# Altium project Droppy_v1.PrjPcb
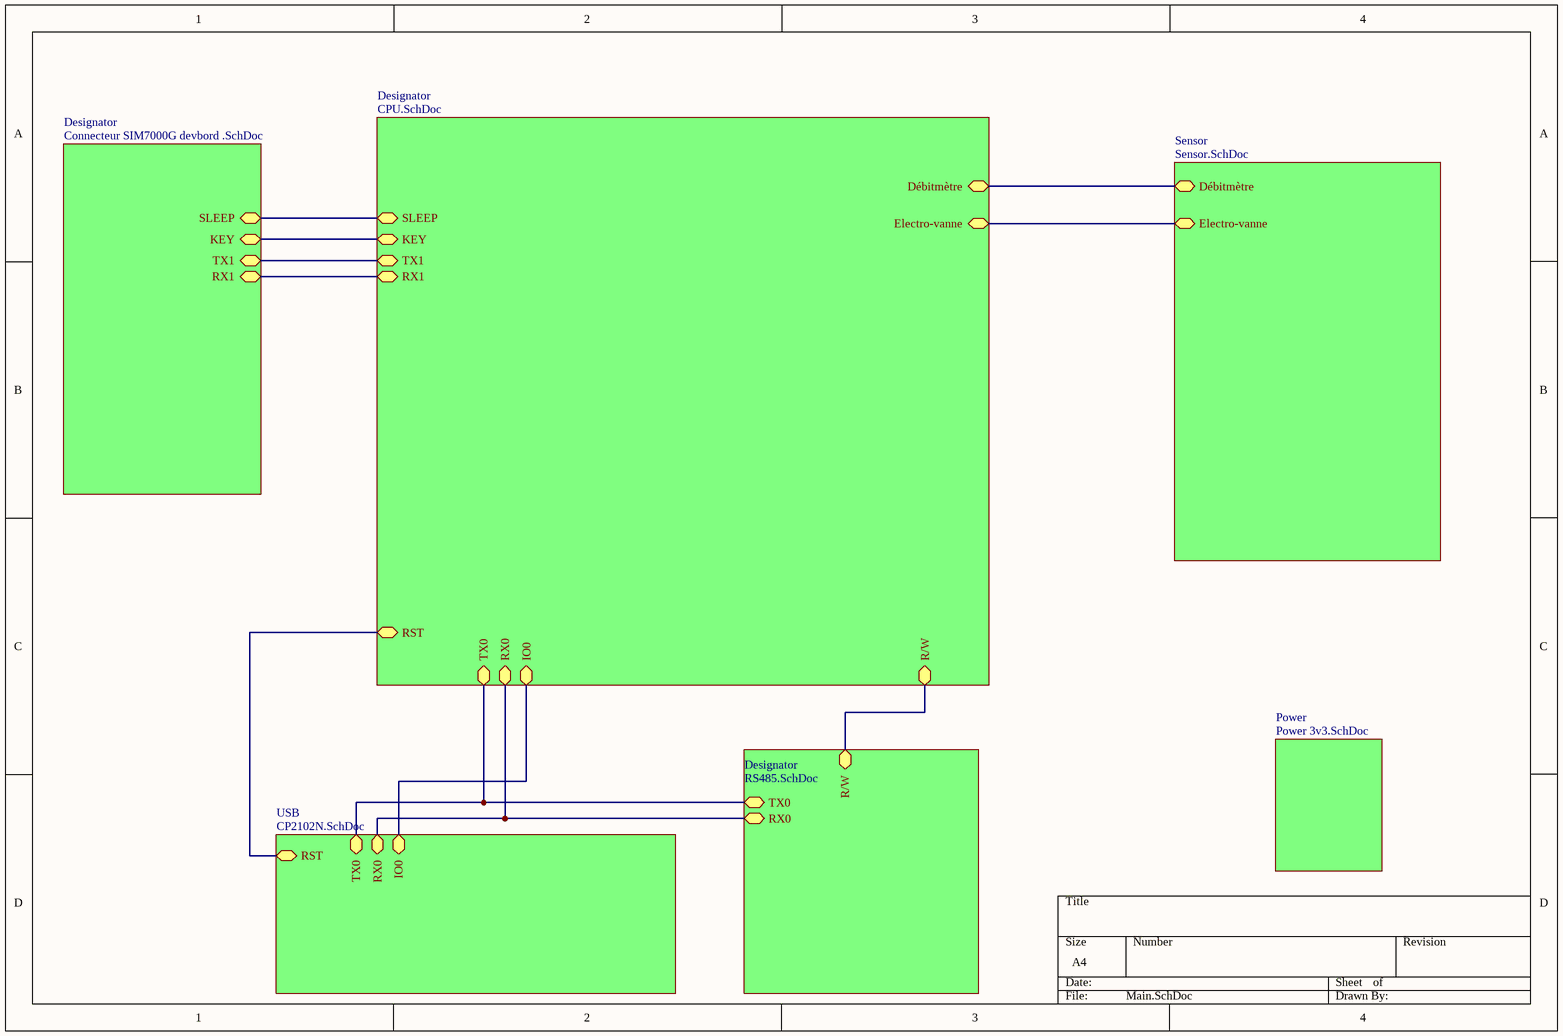
[diagram p0: Main.SchDoc]
7 sheets, 48 parts. Net scope: hierarchical (ports join the sheet entries above them; power ports are global).
Board file: PCB_Droppy_v1.PcbDoc
Sheets:
  Main.SchDoc
    Designator = CPU.SchDoc
    USB = CP2102N.SchDoc
    Power = Power 3v3.SchDoc
    Sensor = Sensor.SchDoc
    Designator = Connecteur SIM7000G devbord .SchDoc
    Designator = RS485.SchDoc

## Sheet Main.SchDoc
size A4; SheetNumber: 1; SheetTotal: 7

### Sub-sheets
Designator = CPU.SchDoc: IO0 (bidir), KEY (bidir), Débitmètre (bidir), Electro-vanne (bidir), R/W (bidir), SLEEP (bidir), RX1 (bidir), TX1 (bidir), TX0 (bidir), RX0 (bidir), RST (bidir)
Designator = Connecteur SIM7000G devbord .SchDoc: RX1 (bidir), TX1 (bidir), KEY (bidir), SLEEP (bidir)
Designator = RS485.SchDoc: RX0 (bidir), TX0 (bidir), R/W (bidir)
Power = Power 3v3.SchDoc: no entries
Sensor = Sensor.SchDoc: Débitmètre (bidir), Electro-vanne (bidir)
USB = CP2102N.SchDoc: TX0 (bidir), RX0 (bidir), IO0 (bidir), RST (bidir)

### Nets
Boot: sheet Designator/IO0, sheet USB/IO0
NetB1_25: sheet Designator/TX0, sheet USB/TX0, sheet Designator/TX0
NetB1_26: sheet Designator/RX0, sheet USB/RX0, sheet Designator/RX0
NetB4_2: sheet Designator/R/W, sheet Designator/R/W
NetC5_2: sheet Designator/Débitmètre, sheet Sensor/Débitmètre
NetJ4_1: sheet Designator/SLEEP, sheet Designator/SLEEP
NetJ4_4: sheet Designator/KEY, sheet Designator/KEY
NetJ4_5: sheet Designator/TX1, sheet Designator/TX1
NetJ4_6: sheet Designator/RX1, sheet Designator/RX1
NetQ1_6: sheet Designator/RST, sheet USB/RST
NetQ2_1: sheet Designator/Electro-vanne, sheet Sensor/Electro-vanne

## Sheet CPU.SchDoc
size A3; SheetNumber: 2; SheetTotal: 7
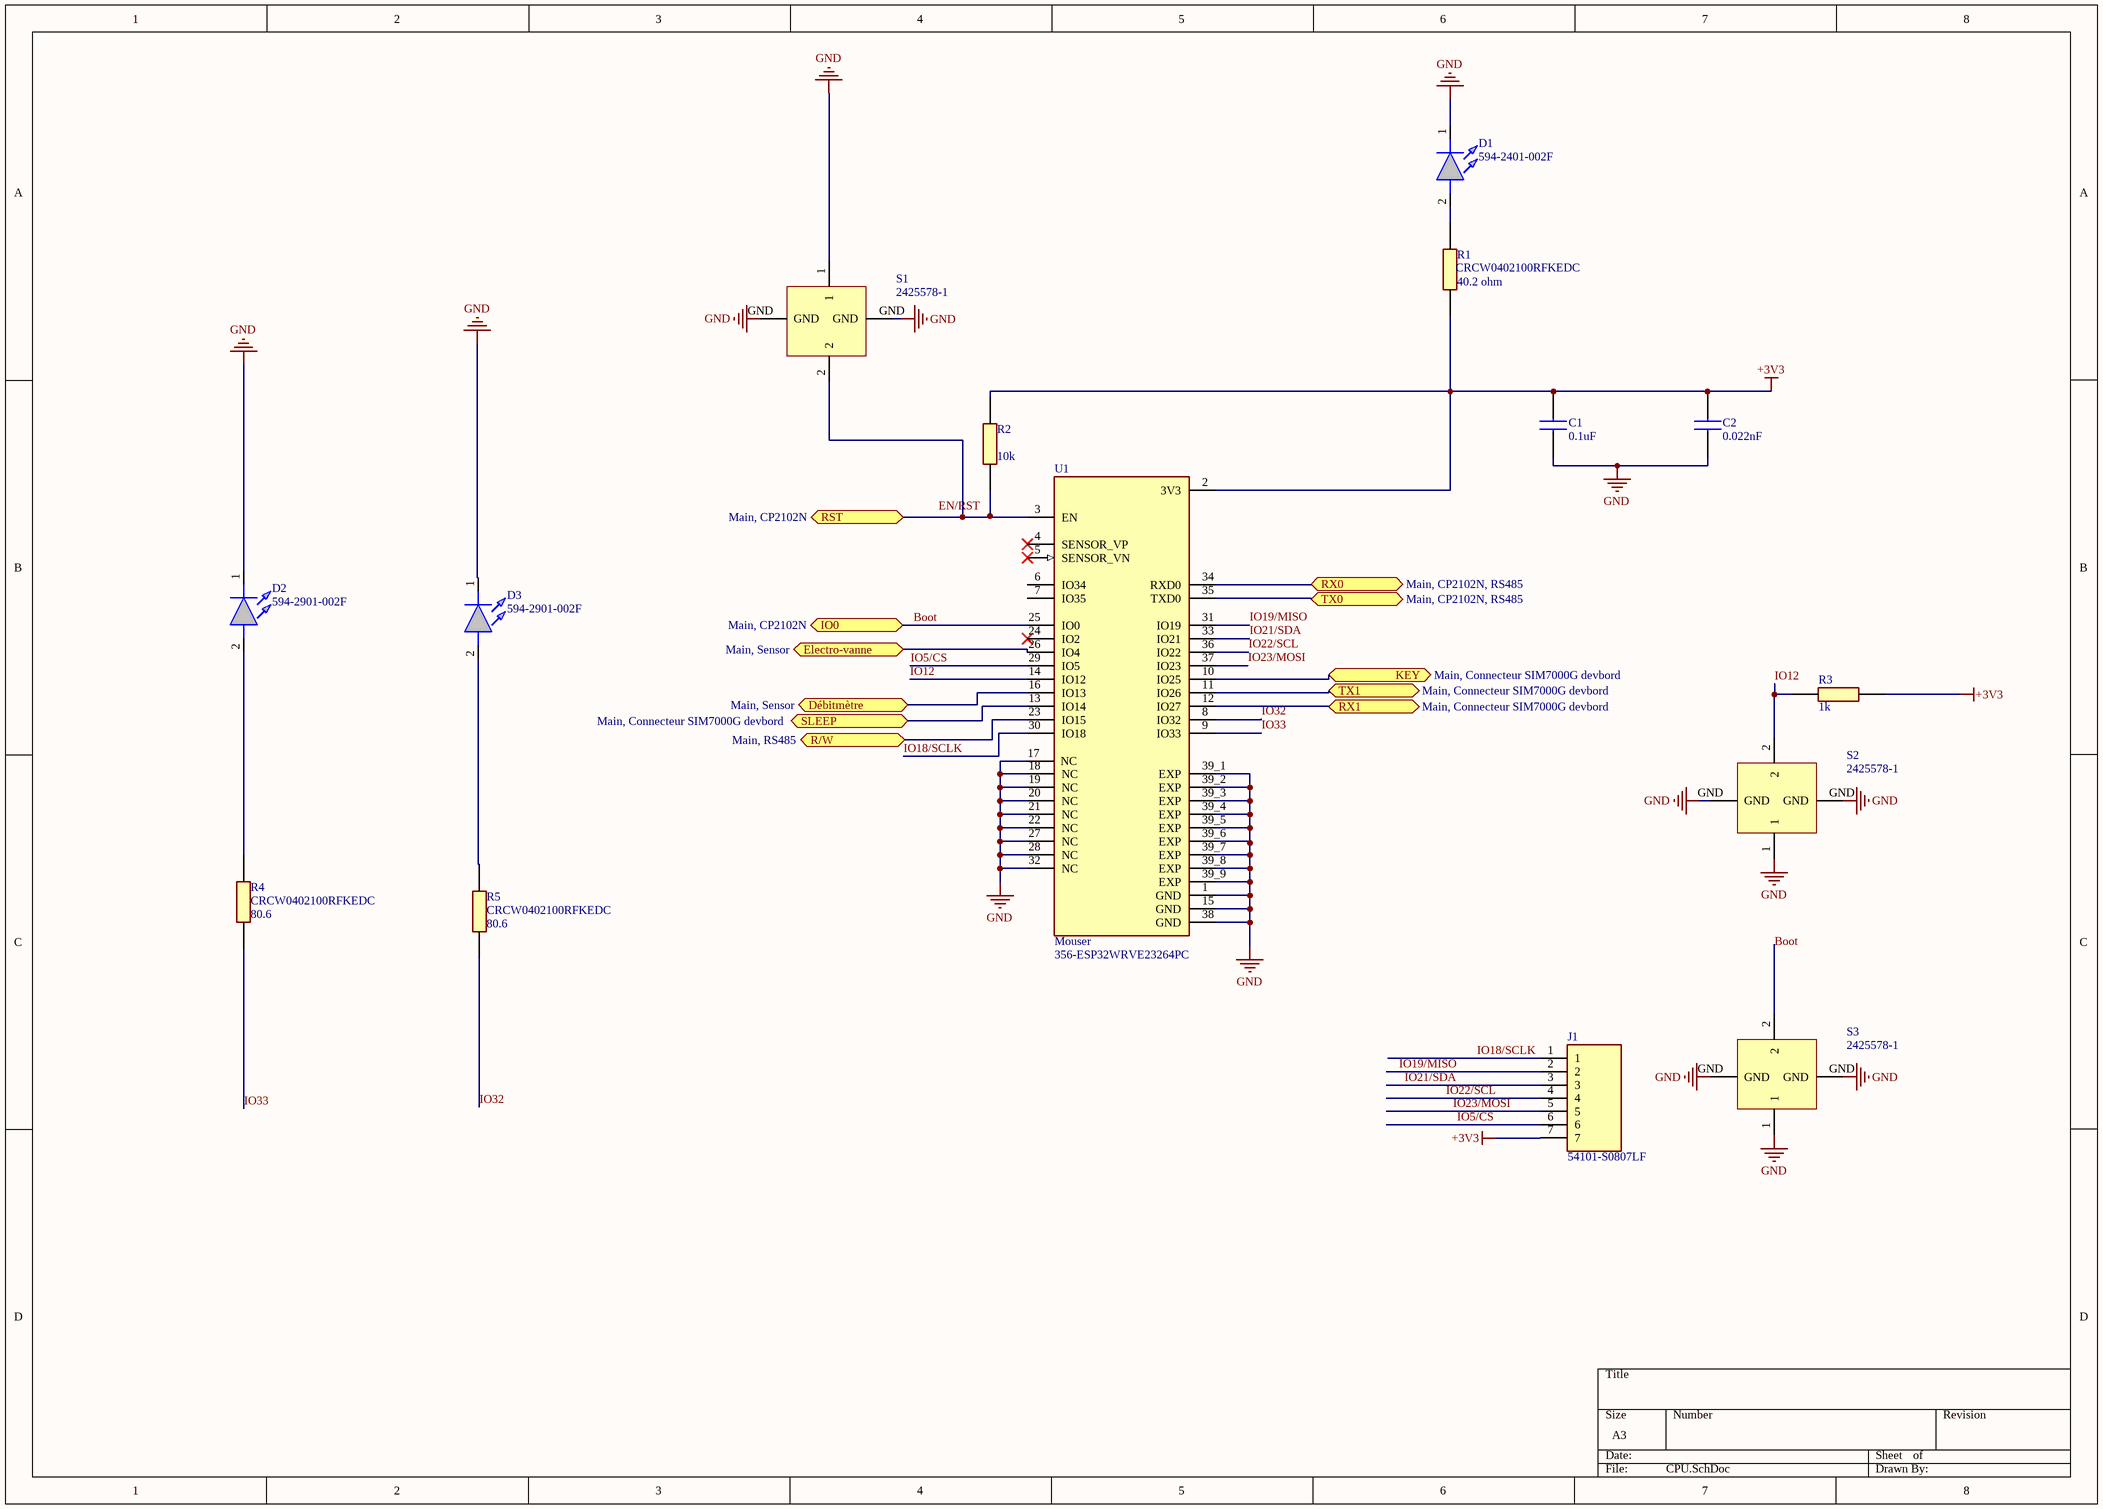
[diagram p1: CPU.SchDoc]

### Parts
C1  value 0.1uF  [CAPC1005X40N]  (hidden comment: 0402YD104KAT2A)
C2  value 0.022nF  [CAPC1005X40N]  (hidden comment: 0402ZD223KAT2A)
D1  594-2401-002F  [5942604013F]
D2  594-2901-002F  [5942604013F]
D3  594-2901-002F  [5942604013F]
J1  54101-S0807LF  [54101S0807LF]
R1  CRCW0402100RFKEDC  value 40.2 ohm  [RESC1005X40N]
R2  value 10k  [RESC1005X40N]  (hidden comment: RC0402FR-0710KL)
R3  value 1k  [RESC1005X40N]  (hidden comment: RT0402BRE071KL)
R4  CRCW0402100RFKEDC  value 80.6  [RESC1005X40N]
R5  CRCW0402100RFKEDC  value 80.6  [RESC1005X40N]
S1  2425578-1  [2425578-1]
S2  2425578-1  [2425578-1]
S3  2425578-1  [2425578-1]
U1  Supplier 1: Mouser  Supplier Part Number 1: 356-ESP32WRVE23264PC  [XCVR_ESP32-WROVER-E-N4R8]  (hidden comment: ESP32-WROVER-IE-N16R8)

### Ports
Débitmètre (bidir, see Main, Sensor), Electro-vanne (bidir, see Main, Sensor), IO0 (bidir, see Main, CP2102N), KEY (bidir, see Main, Connecteur SIM7000G devbord), R/W (bidir, see Main, RS485), RST (bidir, see Main, CP2102N), RX0 (bidir, see Main, CP2102N, RS485), RX1 (bidir, see Main, Connecteur SIM7000G devbord), SLEEP (bidir, see Main, Connecteur SIM7000G devbord), TX0 (bidir, see Main, CP2102N, RS485), TX1 (bidir, see Main, Connecteur SIM7000G devbord)

### Nets
+3V3: C1.2 C2.2 J1.7 R1.1 R2.2 R3.1 U1.2(3V3)
GND: C1.1 C2.1 D1.1(K) D2.1(K) D3.1(K) S1.1 S1.GND S2.1 S2.GND S3.1 S3.GND U1.1(GND) U1.15(GND) U1.17(NC) U1.18(NC) U1.19(NC) U1.20(NC) U1.21(NC) U1.22(NC) U1.27(NC) U1.28(NC) U1.32(NC) U1.38(GND) U1.39_1(EXP) U1.39_2(EXP) U1.39_3(EXP) U1.39_4(EXP) U1.39_5(EXP) U1.39_6(EXP) U1.39_7(EXP) U1.39_8(EXP) U1.39_9(EXP)
Boot: S3.2 U1.25(IO0) ; port IO0
IO5/CS: J1.6 U1.29(IO5)
IO12: R3.2 S2.2 U1.14(IO12)
IO18/SCLK: J1.1 U1.30(IO18)
IO19/MISO: J1.2 U1.31(IO19)
IO21/SDA: J1.3 U1.33(IO21)
IO22/SCL: J1.4 U1.36(IO22)
IO23/MOSI: J1.5 U1.37(IO23)
IO32: R5.1 U1.8(IO32)
IO33: R4.1 U1.9(IO33)
NetB1_25: U1.35(TXD0) ; port TX0
NetB1_26: U1.34(RXD0) ; port RX0
NetB4_2: U1.23(IO15) ; port R/W
NetC5_2: U1.16(IO13) ; port Débitmètre
NetD1_2: D1.2(A) R1.2
NetD2_2: D2.2(A) R4.2
NetD3_2: D3.2(A) R5.2
NetJ4_1: U1.13(IO14) ; port SLEEP
NetJ4_4: U1.10(IO25) ; port KEY
NetJ4_5: U1.11(IO26) ; port TX1
NetJ4_6: U1.12(IO27) ; port RX1
NetQ1_6: R2.1 S1.2 U1.3(EN) ; port RST
NetQ2_1: U1.26(IO4) ; port Electro-vanne

Not connected (* = marked no-connect by the designer): U1 4(SENSOR_VP)* 5(SENSOR_VN)* 6(IO34) 7(IO35) 24(IO2)*

### Notes on the sheet
- Labels drawn without touching a wire or pin: EN/RST

### Library data of the parts
C1 = 0402YD104KAT2A: Capacitor MLCC 0402 100nF 16V AVX 0402 Standard 100nF Ceramic Multilayer Capacitor, 16 V dc, +85C, X5R Dielectric, +/-10% SMD; Geometry.Height: 0.56mm; Mouser Part Number: 581-0402YD104K; Mouser Price/Stock: https://www.mouser.co.uk/ProductDetail/AVX/0402YD104KAT2A?qs=fS3i9m8Z%2FmrV7G1UZb6Y7g%3D%3D; Manufacturer_Name: AVX; Manufacturer_Part_Number: 0402YD104KAT2A; Datasheet Link: *; Supplier Part Number 1: 0402YD104KAT2A; Supplier 1: Avnet
C2 = 0402ZD223KAT2A: Multilayer Ceramic Capacitors MLCC - SMD/SMT 10V 0.022uF X5R 0402 10%; Manufacturer_Name: AVX; Manufacturer_Part_Number: 0402YD104KAT2A; Geometry.Height: 0.56mm; Mouser Part Number: 581-0402ZD223KAT2A; Mouser Price/Stock: https://www.mouser.co.uk/ProductDetail/AVX/0402YD104KAT2A?qs=fS3i9m8Z%2FmrV7G1UZb6Y7g%3D%3D; Datasheet Link: *; Supplier Part Number 1: 0402YD104KAT2A; Supplier 1: Avnet
D1-D3 = 594-2604-013F: LED Circuit Board Indicators 1.6mm IceBlue 2mA 13in reel; Manufacturer_Name: Dialight; Geometry.Height: 4.49mm; Mouser Part Number: 645-594-2604-013F; Mouser Price/Stock: https://www.mouser.co.uk/ProductDetail/Dialight/594-2604-013F?qs=GBLSl2AkiruyIh94PfnoyA%3D%3D; Manufacturer_Part_Number: 594-2604-013F; Datasheet Link: https://www.mouser.cn/datasheet/2/109/C18409B-1729493.pdf
J1 = 54101-S0807LF: BergStik, Board to Board connector, Unshrouded vertical Header, Through Hole, Single Row, 6 Positions, 2.54 mm Pitch.; Manufacturer_Name: Amphenol Communication Solutions; Geometry.Height: 8.58mm; Mouser Part Number: 649-54101-S0807LF; Mouser Price/Stock: https://www.mouser.co.uk/ProductDetail/Amphenol-FCI/54101-S0803LF?qs=iiM6sTJtPEc921tw16XaKg%3D%3D; Manufacturer_Part_Number: 54101-S0807LF; Datasheet Link: https://cdn.amphenol-cs.com/media/wysiwyg/files/drawing/54101.pdf
R1 = CRCW040240R2FKEDC: Résistances à couches épaisses - CMS 1/16watt 40.2ohms 1% Commercial Use; Manufacturer_Name: Vishay; Geometry.Height: 0.4mm; Mouser Part Number: 71-CRCW040240R2FKEDC; Mouser Price/Stock: https://www.mouser.co.uk/ProductDetail/Vishay-Dale/CRCW04024K70JNED?qs=iWCWVRvNViwY%252BotGHUbALg%3D%3D; Manufacturer_Part_Number: CRCW040240R2FKEDC; Datasheet Link: http://www.vishay.com/docs/20035/dcrcwe3.pdf; Supplier 1: Avnet; Supplier Part Number 1: 59M6737
R2 = RC0402FR-0710KL: Yageo 10k, 0402 (1005M) Thick Film SMD Resistor +/-1% 0.063W - RC0402FR-0710KL; Geometry.Height: 0.4mm; Mouser Part Number: 603-RC0402FR-0710KL; Mouser Price/Stock: https://www.mouser.co.uk/ProductDetail/YAGEO/RC0402FR-0710KL?qs=I1mnnYJTTsxUoNwrUsQExA%3D%3D; Manufacturer_Name: YAGEO; Manufacturer_Part_Number: RC0402FR-0710KL; Datasheet Link: https://componentsearchengine.com/Datasheets/2/RC0402FR-0710KL.pdf; Supplier Part Number 1: 7468275; Supplier 1: Future Electronics
R3 = RT0402BRE071KL: Thin Film Resistors - SMD 1/16W 1K ohm .1% 50ppm; Manufacturer_Name: YAGEO; Geometry.Height: 0.4mm; Mouser Part Number: 603-RT0402BRE071KL; Mouser Price/Stock: https://www.mouser.co.uk/ProductDetail/YAGEO/RC0402FR-0710KL?qs=I1mnnYJTTsxUoNwrUsQExA%3D%3D; Manufacturer_Part_Number: RT0402BRE071KL; Datasheet Link: https://componentsearchengine.com/Datasheets/2/RC0402FR-0710KL.pdf; Supplier 1: Future Electronics; Supplier Part Number 1: 3025706
R4 R5 = CRCW040280R6FKED: Résistances à couches épaisses - CMS 1/16watt 80.6ohms 1%; Manufacturer_Name: Vishay; Geometry.Height: 0.4mm; Mouser Part Number: 71-CRCW0402-80.6-E3; Mouser Price/Stock: https://www.mouser.co.uk/ProductDetail/Vishay-Dale/CRCW04024K70JNED?qs=iWCWVRvNViwY%252BotGHUbALg%3D%3D; Manufacturer_Part_Number: CRCW040280R6FKED; Datasheet Link: http://www.vishay.com/docs/20035/dcrcwe3.pdf; Supplier 1: Avnet; Supplier Part Number 1: 59M6737
S1-S3 = 2425578-1: Interrupteurs de contact Edge mount, right angle tactile, 160gf
U1 = ESP32-WROVER-E-N4R8: Bluetooth, WiFi 802.11b/g/n, Bluetooth v4.2 +EDR Transceiver Module 2.4GHz ~ 2.5GHz PCB Trace Surface Mount; MF: Espressif Systems; MP: ESP32WROVEREN4R8; SnapEDA_Link: https://www.snapeda.com/parts/ESP32WROVEREN4R8/Espressif+Systems/view-part/?ref=snap; Price: None; Check_prices: https://www.snapeda.com/parts/ESP32WROVEREN4R8/Espressif+Systems/view-part/?ref=eda; Value: *; Package: None; Availability: In Stock; Purchase-URL: https://pricing.snapeda.com/search/part/ESP32WROVEREN4R8/?ref=eda

## Sheet CP2102N.SchDoc
size A3; SheetNumber: 3; SheetTotal: 7
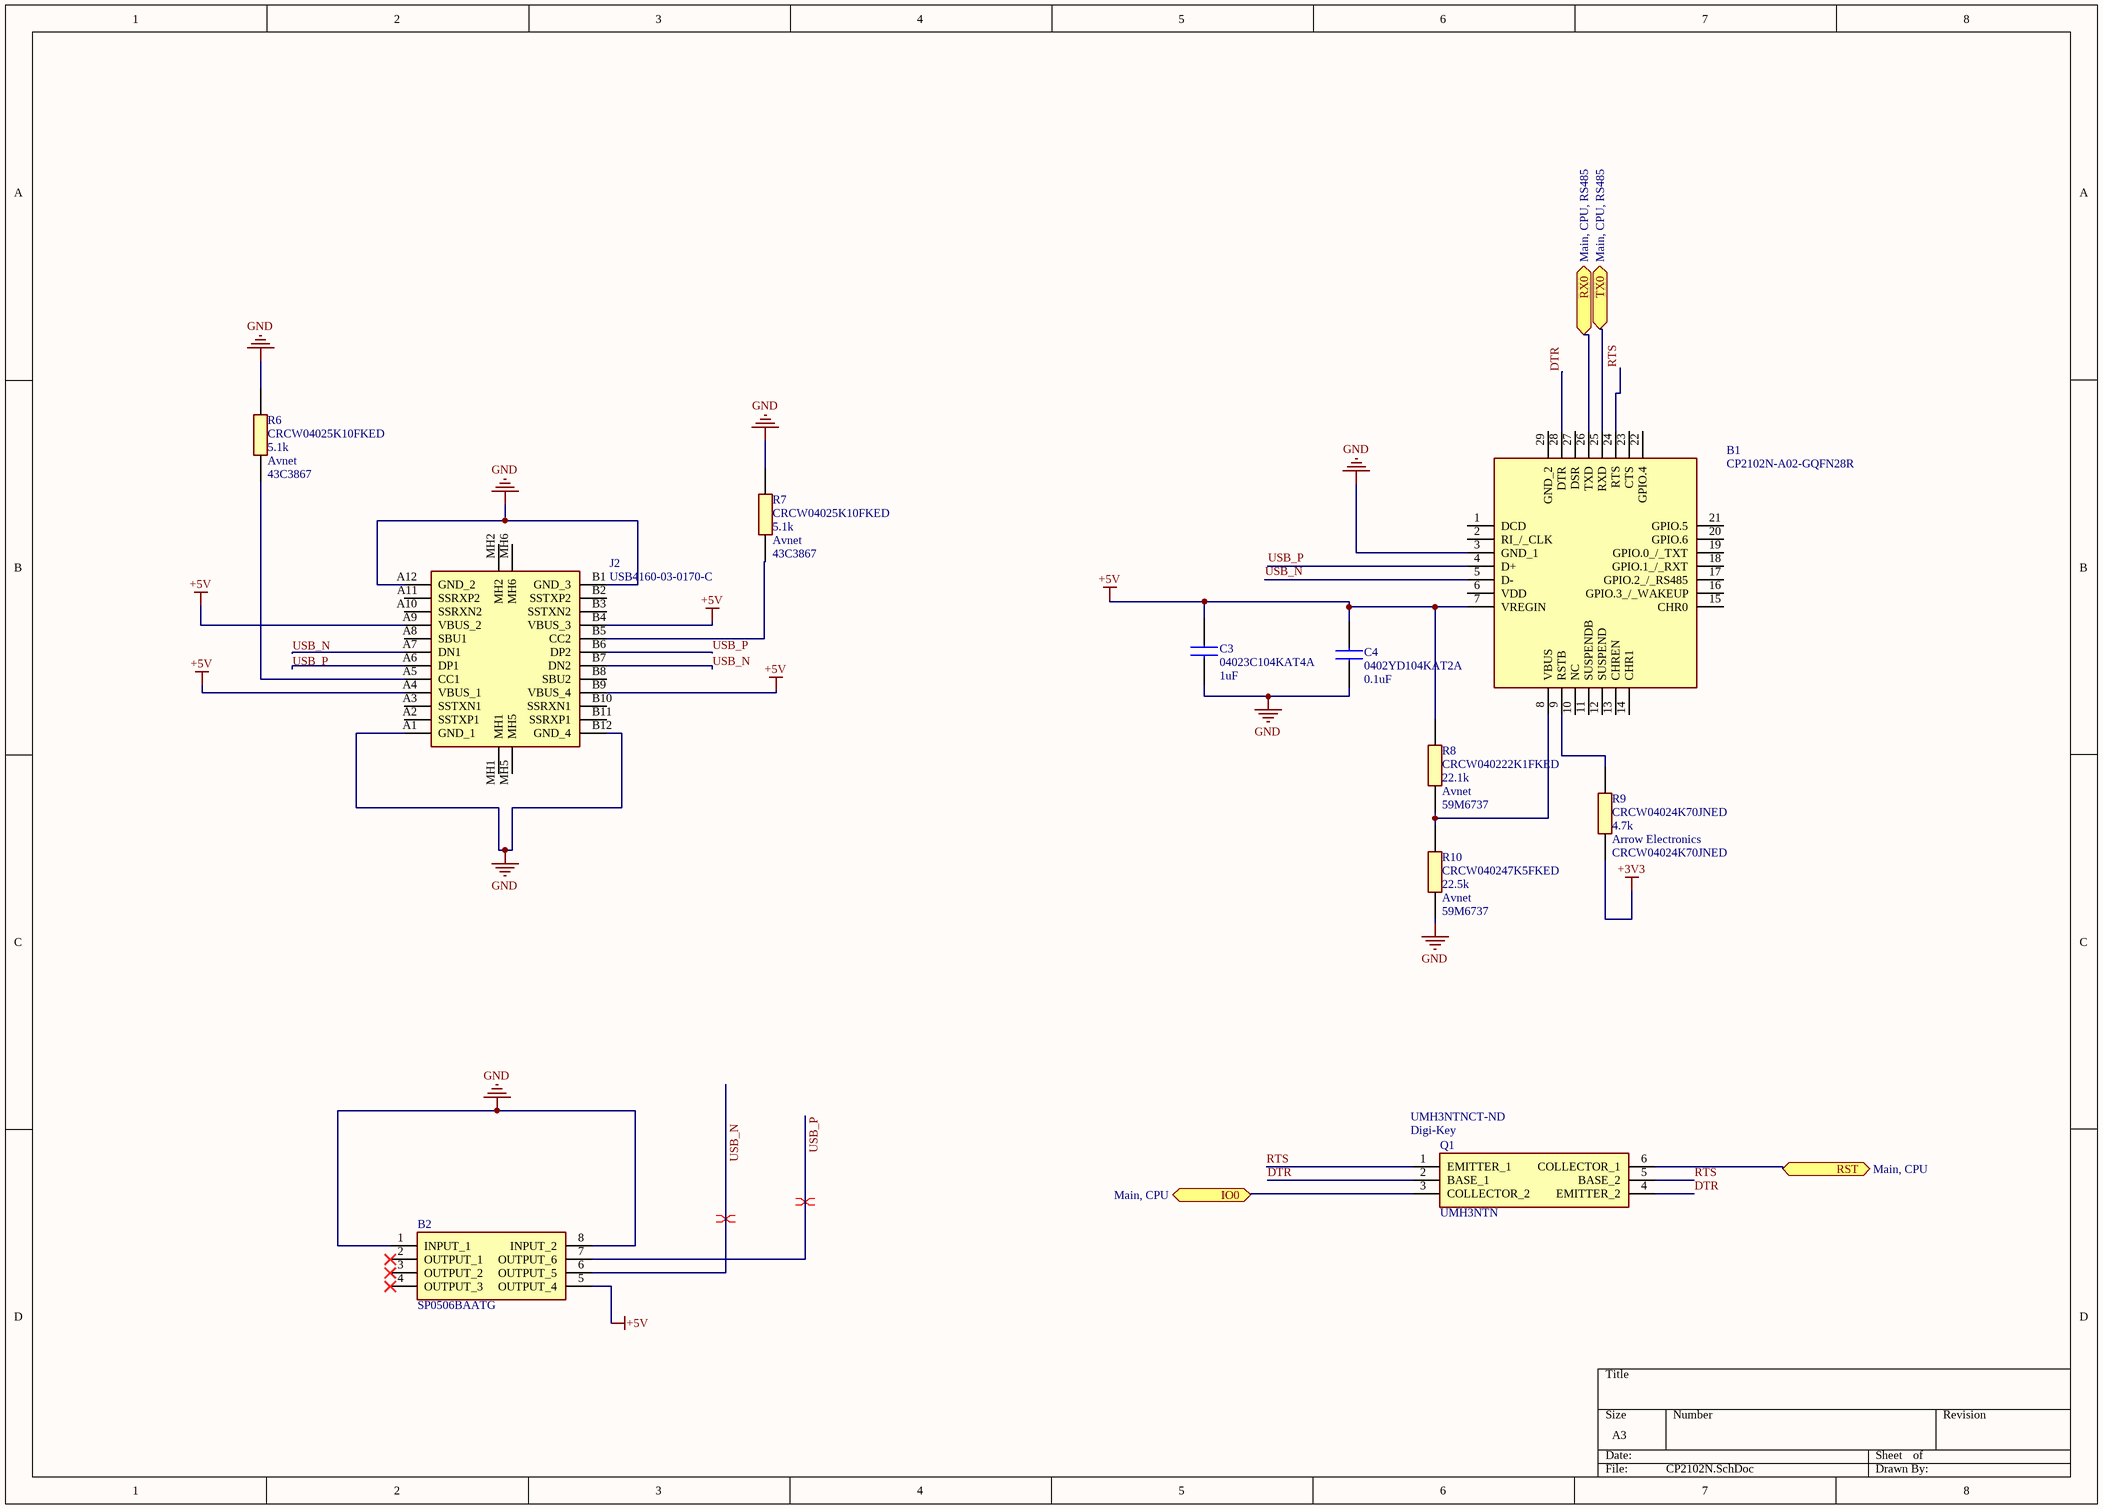
[diagram p2: CP2102N.SchDoc]

### Parts
B1  CP2102N-A02-GQFN28R  [QFN50P500X500X80-29N-D]
B2  SP0506BAATG  [SOP65P488X117-8N]
C3  04023C104KAT4A  value 1uF  [CAPC1005X40N]
C4  0402YD104KAT2A  value 0.1uF  [CAPC1005X40N]
J2  USB4160-03-0170-C  [USB4160030170C]
Q1  UMH3NTN  Supplier 1: Digi-Key  Supplier Part Number 1: UMH3NTNCT-ND  [UMH3NTN]
R6  CRCW04025K10FKED  value 5.1k  Supplier 1: Avnet  Supplier Part Number 1: 43C3867  [RESC1005X40N]
R7  CRCW04025K10FKED  value 5.1k  Supplier 1: Avnet  Supplier Part Number 1: 43C3867  [RESC1005X40N]
R8  CRCW040222K1FKED  value 22.1k  Supplier 1: Avnet  Supplier Part Number 1: 59M6737  [RESC1005X40N]
R9  CRCW04024K70JNED  value 4.7k  Supplier 1: Arrow Electronics  [RESC1005X40N]
R10  CRCW040247K5FKED  value 22.5k  Supplier 1: Avnet  Supplier Part Number 1: 59M6737  [RESC1005X40N]

### Ports
IO0 (bidir, see Main, CPU), RST (bidir, see Main, CPU), RX0 (bidir, see Main, CPU, RS485), TX0 (bidir, see Main, CPU, RS485)

### Nets
+3V3: R9.1
+5V: B1.7(VREGIN) B2.5(OUTPUT_4) C3.2 C4.2 J2.A4(VBUS_1) J2.A9(VBUS_2) J2.B4(VBUS_3) J2.B9(VBUS_4) R8.2
GND: B1.3(GND_1) B2.1(INPUT_1) B2.8(INPUT_2) C3.1 C4.1 J2.A1(GND_1) J2.A12(GND_2) J2.B1(GND_3) J2.B12(GND_4) R6.2 R7.2 R10.1
Boot: Q1.3(COLLECTOR_2) ; port IO0
DTR: B1.28(DTR) Q1.2(BASE_1) Q1.4(EMITTER_2)
RTS: B1.24(RTS) Q1.1(EMITTER_1) Q1.5(BASE_2)
USB_N: B1.5(D-) B2.6(OUTPUT_5) J2.A7(DN1) J2.B7(DN2)
USB_P: B1.4(D+) B2.7(OUTPUT_6) J2.A6(DP1) J2.B6(DP2)
NetB1_8: B1.8(VBUS) R8.1 R10.2
NetB1_9: B1.9(RSTB) R9.2
NetB1_25: B1.25(RXD) ; port TX0
NetB1_26: B1.26(TXD) ; port RX0
NetJ2_A5: J2.A5(CC1) R6.1
NetJ2_B5: J2.B5(CC2) R7.1
NetQ1_6: Q1.6(COLLECTOR_1) ; port RST

Not connected (* = marked no-connect by the designer): B1 1(DCD) 2(RI_/_CLK) 6(VDD) 10(NC) 11(SUSPENDB) 12(SUSPEND) 13(CHREN) 14(CHR1) 15(CHR0) 16(GPIO.3_/_WAKEUP) 17(GPIO.2_/_RS485) 18(GPIO.1_/_RXT) 19(GPIO.0_/_TXT) 20(GPIO.6) 21(GPIO.5) 22(GPIO.4) 23(CTS) 27(DSR) 29(GND_2); B2 2(OUTPUT_1)* 3(OUTPUT_2)* 4(OUTPUT_3)*; J2 A2(SSTXP1) A3(SSTXN1) A8(SBU1) A10(SSRXN2) A11(SSRXP2) B2(SSTXP2) B3(SSTXN2) B8(SBU2) B10(SSRXN1) B11(SSRXP1) MH1 MH2 MH5 MH6

### Layout directives
differential pair: USB_N, USB_P

### Library data of the parts
B1 = CP2102N-A02-GQFN28R: USB Interface IC USB to UART bridge - QFN28; Manufacturer_Name: Silicon Labs; Geometry.Height: 0.8mm; Manufacturer_Part_Number: CP2102N-A02-GQFN28R; Mouser Part Number: 634-CP2102NA02QFN28R; Mouser Price/Stock: https://www.mouser.co.uk/ProductDetail/Silicon-Labs/CP2102N-A02-GQFN28R?qs=u16ybLDytRag4qKvSH3fTw%3D%3D; Arrow Part Number: CP2102N-A02-GQFN28R; Arrow Price/Stock: https://www.arrow.com/en/products/cp2102n-a02-gqfn28r/silicon-labs?region=nac; Datasheet Link: https://www.silabs.com/documents/public/data-sheets/cp2102n-datasheet.pdf
B2 = SP0506BAATG: TVS Diode Arrays; Manufacturer_Name: LITTELFUSE; Geometry.Height: 1.17mm; Mouser Part Number: 576-SP0506BAATG; Mouser Price/Stock: https://www.mouser.co.uk/ProductDetail/Littelfuse/SP0506BAATG?qs=RnOBYWd%2Fz7c6KTUitxDieg%3D%3D; Manufacturer_Part_Number: SP0506BAATG; Datasheet Link: https://www.littelfuse.com/~/media/electronics/datasheets/tvs_diode_arrays/littelfuse_tvs_diode_array_sp05_datasheet.pdf.pdf; Supplier 1: Arrow Electronics; Supplier Part Number 1: SP0506BAATG
C3 = 04023C104KAT4A: Multilayer Ceramic Capacitors MLCC - SMD/SMT 25V .1uF X7R 0402; Manufacturer_Name: AVX; Geometry.Height: 0.56mm; Mouser Part Number: 581-04023C104KAT4A; Mouser Price/Stock: https://www.mouser.co.uk/ProductDetail/AVX/0402YD104KAT2A?qs=fS3i9m8Z%2FmrV7G1UZb6Y7g%3D%3D; Manufacturer_Part_Number: 04023C104KAT4A; Datasheet Link: *; Supplier Part Number 1: 0402YD104KAT2A; Supplier 1: Avnet
C4 = 0402YD104KAT2A: as C1 on sheet CPU; Mouser Part Number: 581-0402YD104K; Mouser Price/Stock: https://www.mouser.co.uk/ProductDetail/AVX/0402YD104KAT2A?qs=fS3i9m8Z%2FmrV7G1UZb6Y7g%3D%3D; Manufacturer_Name: AVX; Manufacturer_Part_Number: 0402YD104KAT2A; Datasheet Link: *; Supplier Part Number 1: 0402YD104KAT2A; Supplier 1: Avnet
J2 = USB4160-03-0170-C: USB Connectors USB-C Rec 3u" Vert 24P SMT 1.7mm TH stakes H7.46mm T+R+Cap; Manufacturer_Name: GCT (GLOBAL CONNECTOR TECHNOLOGY); Geometry.Height: 7.66mm; Mouser Part Number: 640-USB4160-3-0170-C; Mouser Price/Stock: https://www.mouser.co.uk/ProductDetail/GCT/USB4160-03-0170-C?qs=vvQtp7zwQdMCGQNngnxScA%3D%3D; Manufacturer_Part_Number: USB4160-03-0170-C; Datasheet Link: https://gct.co/Files/Drawings/USB4160.pdf?v=75f6cea7-84cd-41d4-89e8-137dc7b10777
Q1 = UMH3NTN: Bipolar Transistors - Pre-Biased DUAL NPN 50V 100MA SOT-363; Manufacturer_Name: ROHM Semiconductor; Geometry.Height: 1mm; Mouser Part Number: 755-UMH3NTN; Mouser Price/Stock: https://www.mouser.co.uk/ProductDetail/ROHM-Semiconductor/UMH3NTN?qs=4kLU8WoGk0st6ahJ6z2bmw%3D%3D; Manufacturer_Part_Number: UMH3NTN; Datasheet Link: https://componentsearchengine.com/Datasheets/2/UMH3NTN.pdf
R6 R7 = CRCW04025K10FKED: Thick Film Resistors - SMD 3/4watt 5.1Kohms 5%; Manufacturer_Name: Vishay; Geometry.Height: 0.4mm; Mouser Part Number: 71-CRCW0402-5.1K-E3; Mouser Price/Stock: https://www.mouser.co.uk/ProductDetail/Vishay-Dale/CRCW04024K70JNED?qs=iWCWVRvNViwY%252BotGHUbALg%3D%3D; Manufacturer_Part_Number: CRCW04025K10FKED; Datasheet Link: http://www.vishay.com/docs/20035/dcrcwe3.pdf
R8 = CRCW040222K1FKED: Résistances à couches épaisses - CMS 1/16watt 22.1Kohms 1%; Manufacturer_Name: Vishay; Geometry.Height: 0.4mm; Mouser Part Number: 71-CRCW0402-22.1K-E3; Mouser Price/Stock: https://www.mouser.co.uk/ProductDetail/Vishay-Dale/CRCW04024K70JNED?qs=iWCWVRvNViwY%252BotGHUbALg%3D%3D; Manufacturer_Part_Number: CRCW040222K1FKED; Datasheet Link: http://www.vishay.com/docs/20035/dcrcwe3.pdf
R9 = CRCW04024K70JNED: VISHAY - CRCW04024K70JNED - RES, THICK FILM, 4K7, 5%, 0.063W, 0402; Geometry.Height: 0.4mm; Mouser Part Number: 71-CRCW0402J-4.7K-E3; Mouser Price/Stock: https://www.mouser.co.uk/ProductDetail/Vishay-Dale/CRCW04024K70JNED?qs=iWCWVRvNViwY%252BotGHUbALg%3D%3D; Manufacturer_Name: Vishay; Manufacturer_Part_Number: CRCW04024K70JNED; Datasheet Link: http://www.vishay.com/docs/20035/dcrcwe3.pdf; Supplier Part Number 1: CRCW04024K70JNED
R10 = CRCW040247K5FKED: Résistances à couches épaisses - CMS 1/16watt 47.5Kohms 1%; Manufacturer_Name: Vishay; Geometry.Height: 0.4mm; Mouser Part Number: 71-CRCW0402-47.5K-E3; Mouser Price/Stock: https://www.mouser.co.uk/ProductDetail/Vishay-Dale/CRCW04024K70JNED?qs=iWCWVRvNViwY%252BotGHUbALg%3D%3D; Manufacturer_Part_Number: CRCW040247K5FKED; Datasheet Link: http://www.vishay.com/docs/20035/dcrcwe3.pdf

## Sheet Power 3v3.SchDoc
size A4; SheetNumber: 5; SheetTotal: 7
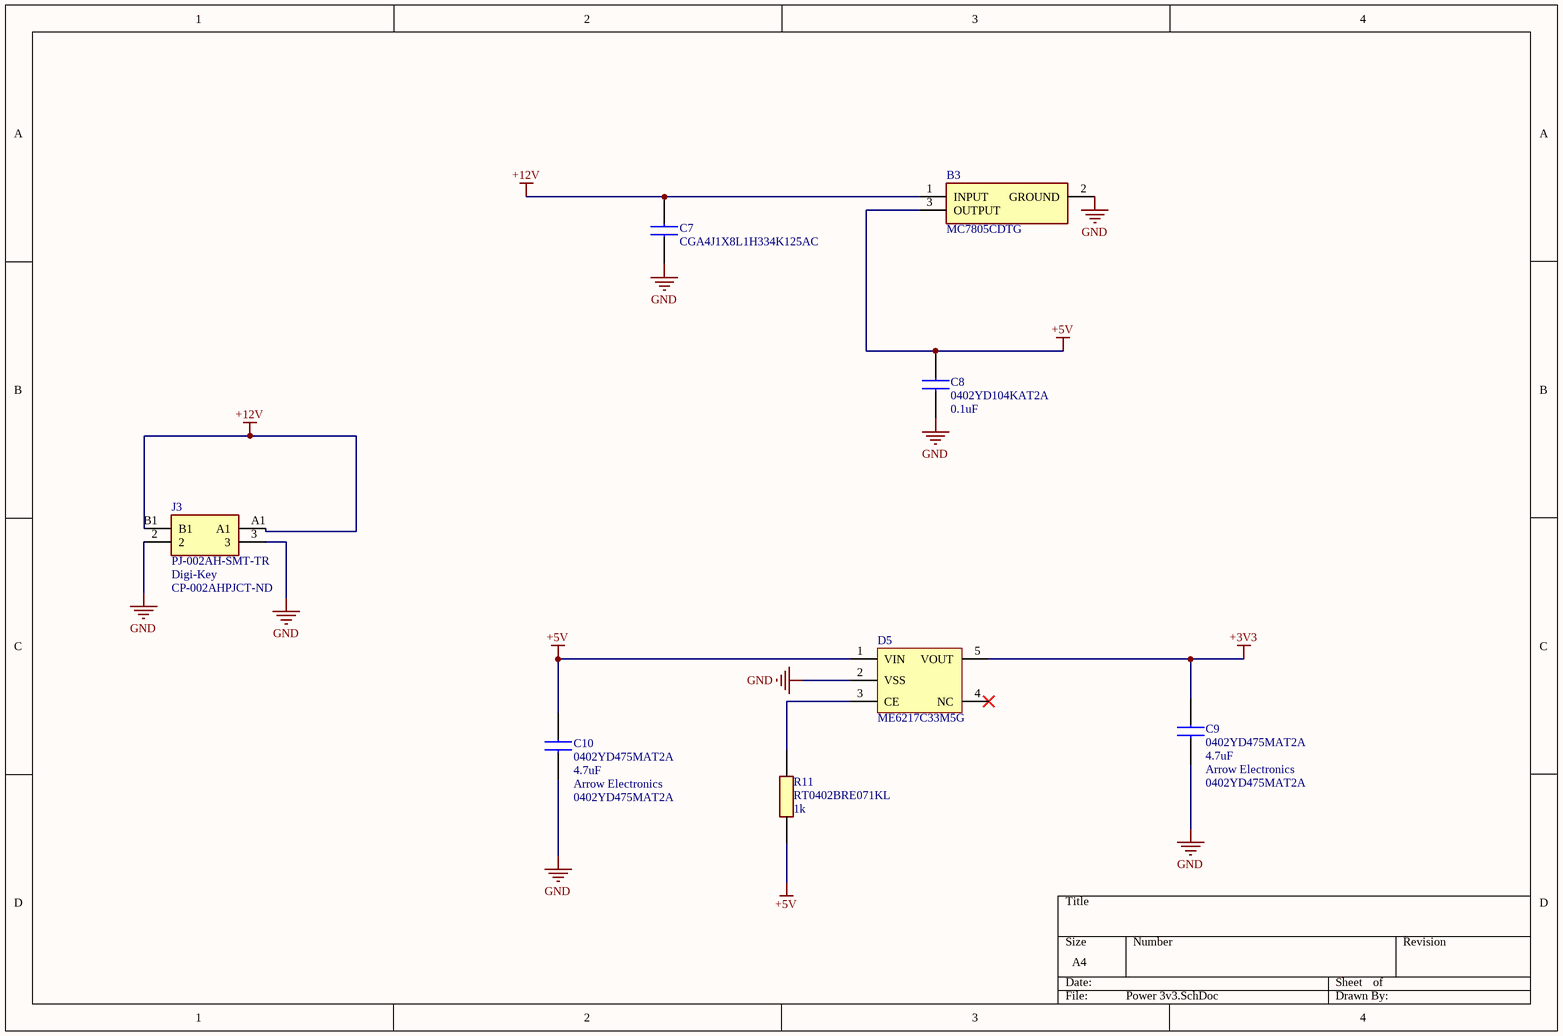
[diagram p3: Power 3v3.SchDoc]

### Parts
B3  MC7805CDTG  [MC7805CDTG]
C7  CGA4J1X8L1H334K125AC  [CAPC2012X145N]
C8  0402YD104KAT2A  value 0.1uF  [CAPC1005X40N]
C9  0402YD475MAT2A  value 4.7uF  Supplier 1: Arrow Electronics  [CAPC1005X40N]
C10  0402YD475MAT2A  value 4.7uF  Supplier 1: Arrow Electronics  [CAPC1005X40N]
D5  ME6217C33M5G  [SOT-23-5_L2.9-W1.6-P0.95-LS2.8-BR]
J3  PJ-002AH-SMT-TR  Supplier 1: Digi-Key  Supplier Part Number 1: CP-002AHPJCT-ND  [PJ002AHSMTTR]
R11  RT0402BRE071KL  value 1k  [RESC1005X40N]

### Nets
+3V3: C9.2 D5.5(VOUT)
+5V: B3.3(OUTPUT) C8.2 C10.2 D5.1(VIN) R11.1
+12V: B3.1(INPUT) C7.2 J3.A1 J3.B1
GND: B3.2(GROUND) C7.1 C8.1 C9.1 C10.1 D5.2(VSS) J3.2 J3.3
NetD5_3: D5.3(CE) R11.2

Not connected (* = marked no-connect by the designer): D5 4(NC)*

### Library data of the parts
B3 = MC7805CDTG: Linear Voltage Regulators 5V 1A Positive; Manufacturer_Name: onsemi; Geometry.Height: 2.51mm; Mouser Part Number: 863-MC7805CDTG; Mouser Price/Stock: https://www.mouser.co.uk/ProductDetail/onsemi/MC7805CDTG?qs=%252B9%2Fcbd0IE0RdeBGvK4GFRg%3D%3D; Manufacturer_Part_Number: MC7805CDTG; Datasheet Link: https://www.onsemi.com/pdf/datasheet/mc7800-d.pdf
C7 = CGA4J1X8L1H334K125AC: Multilayer Ceramic Chip Capacitors, Capacitance=0.33uF, LxWxT:2x1.25x1.25mm; Manufacturer_Name: TDK; Geometry.Height: 1.45mm; Mouser Part Number: 810-CGA4J1X8L1H334K1; Mouser Price/Stock: https://www.mouser.co.uk/ProductDetail/TDK/CGA4J1X8L1H334K125AC?qs=W%2FMpXkg%252BdQ7wXGeZmfNwXQ%3D%3D; Manufacturer_Part_Number: CGA4J1X8L1H334K125AC; Datasheet Link: *
C8 = 0402YD104KAT2A: as C1 on sheet CPU; Mouser Part Number: 581-0402YD104K; Mouser Price/Stock: https://www.mouser.co.uk/ProductDetail/AVX/0402YD104KAT2A?qs=fS3i9m8Z%2FmrV7G1UZb6Y7g%3D%3D; Manufacturer_Name: AVX; Manufacturer_Part_Number: 0402YD104KAT2A; Datasheet Link: *; Supplier Part Number 1: 0402YD104KAT2A; Supplier 1: Avnet
C9 C10 = 0402YD475MAT2A: Multilayer Ceramic Capacitors MLCC - SMD/SMT 16V 4.7uF 20% X5R 0402; Manufacturer_Name: AVX; Geometry.Height: 0.71mm; Mouser Part Number: 581-0402YD475MAT2A; Mouser Price/Stock: https://www.mouser.co.uk/ProductDetail/AVX/0402YD475MAT2A?qs=s6nfgz3miVxwCmHE9M6tUg%3D%3D; Manufacturer_Part_Number: 0402YD475MAT2A; Datasheet Link: *; Supplier Part Number 1: 0402YD475MAT2A
D5 = ME6217C33M5G / SOT23-5
J3 = PJ-002AH-SMT-TR: DC Power Connectors Power Jacks; Manufacturer_Name: CUI Devices; Geometry.Height: 11.23mm; Mouser Part Number: 490-PJ-002AH-SMT-TR; Mouser Price/Stock: https://www.mouser.co.uk/ProductDetail/CUI-Devices/PJ-002AH-SMT-TR?qs=WyjlAZoYn52i5LSWfoFS9w%3D%3D; Manufacturer_Part_Number: PJ-002AH-SMT-TR; Datasheet Link: https://www.cuidevices.com/product/resource/pj-002ah-smt-tr.pdf
R11 = RT0402BRE071KL: as R3 on sheet CPU; Mouser Part Number: 603-RT0402BRE071KL; Mouser Price/Stock: https://www.mouser.co.uk/ProductDetail/YAGEO/RC0402FR-0710KL?qs=I1mnnYJTTsxUoNwrUsQExA%3D%3D; Manufacturer_Part_Number: RT0402BRE071KL; Datasheet Link: https://componentsearchengine.com/Datasheets/2/RC0402FR-0710KL.pdf; Supplier 1: Future Electronics; Supplier Part Number 1: 3025706

## Sheet Sensor.SchDoc
size A3; SheetNumber: 4; SheetTotal: 7
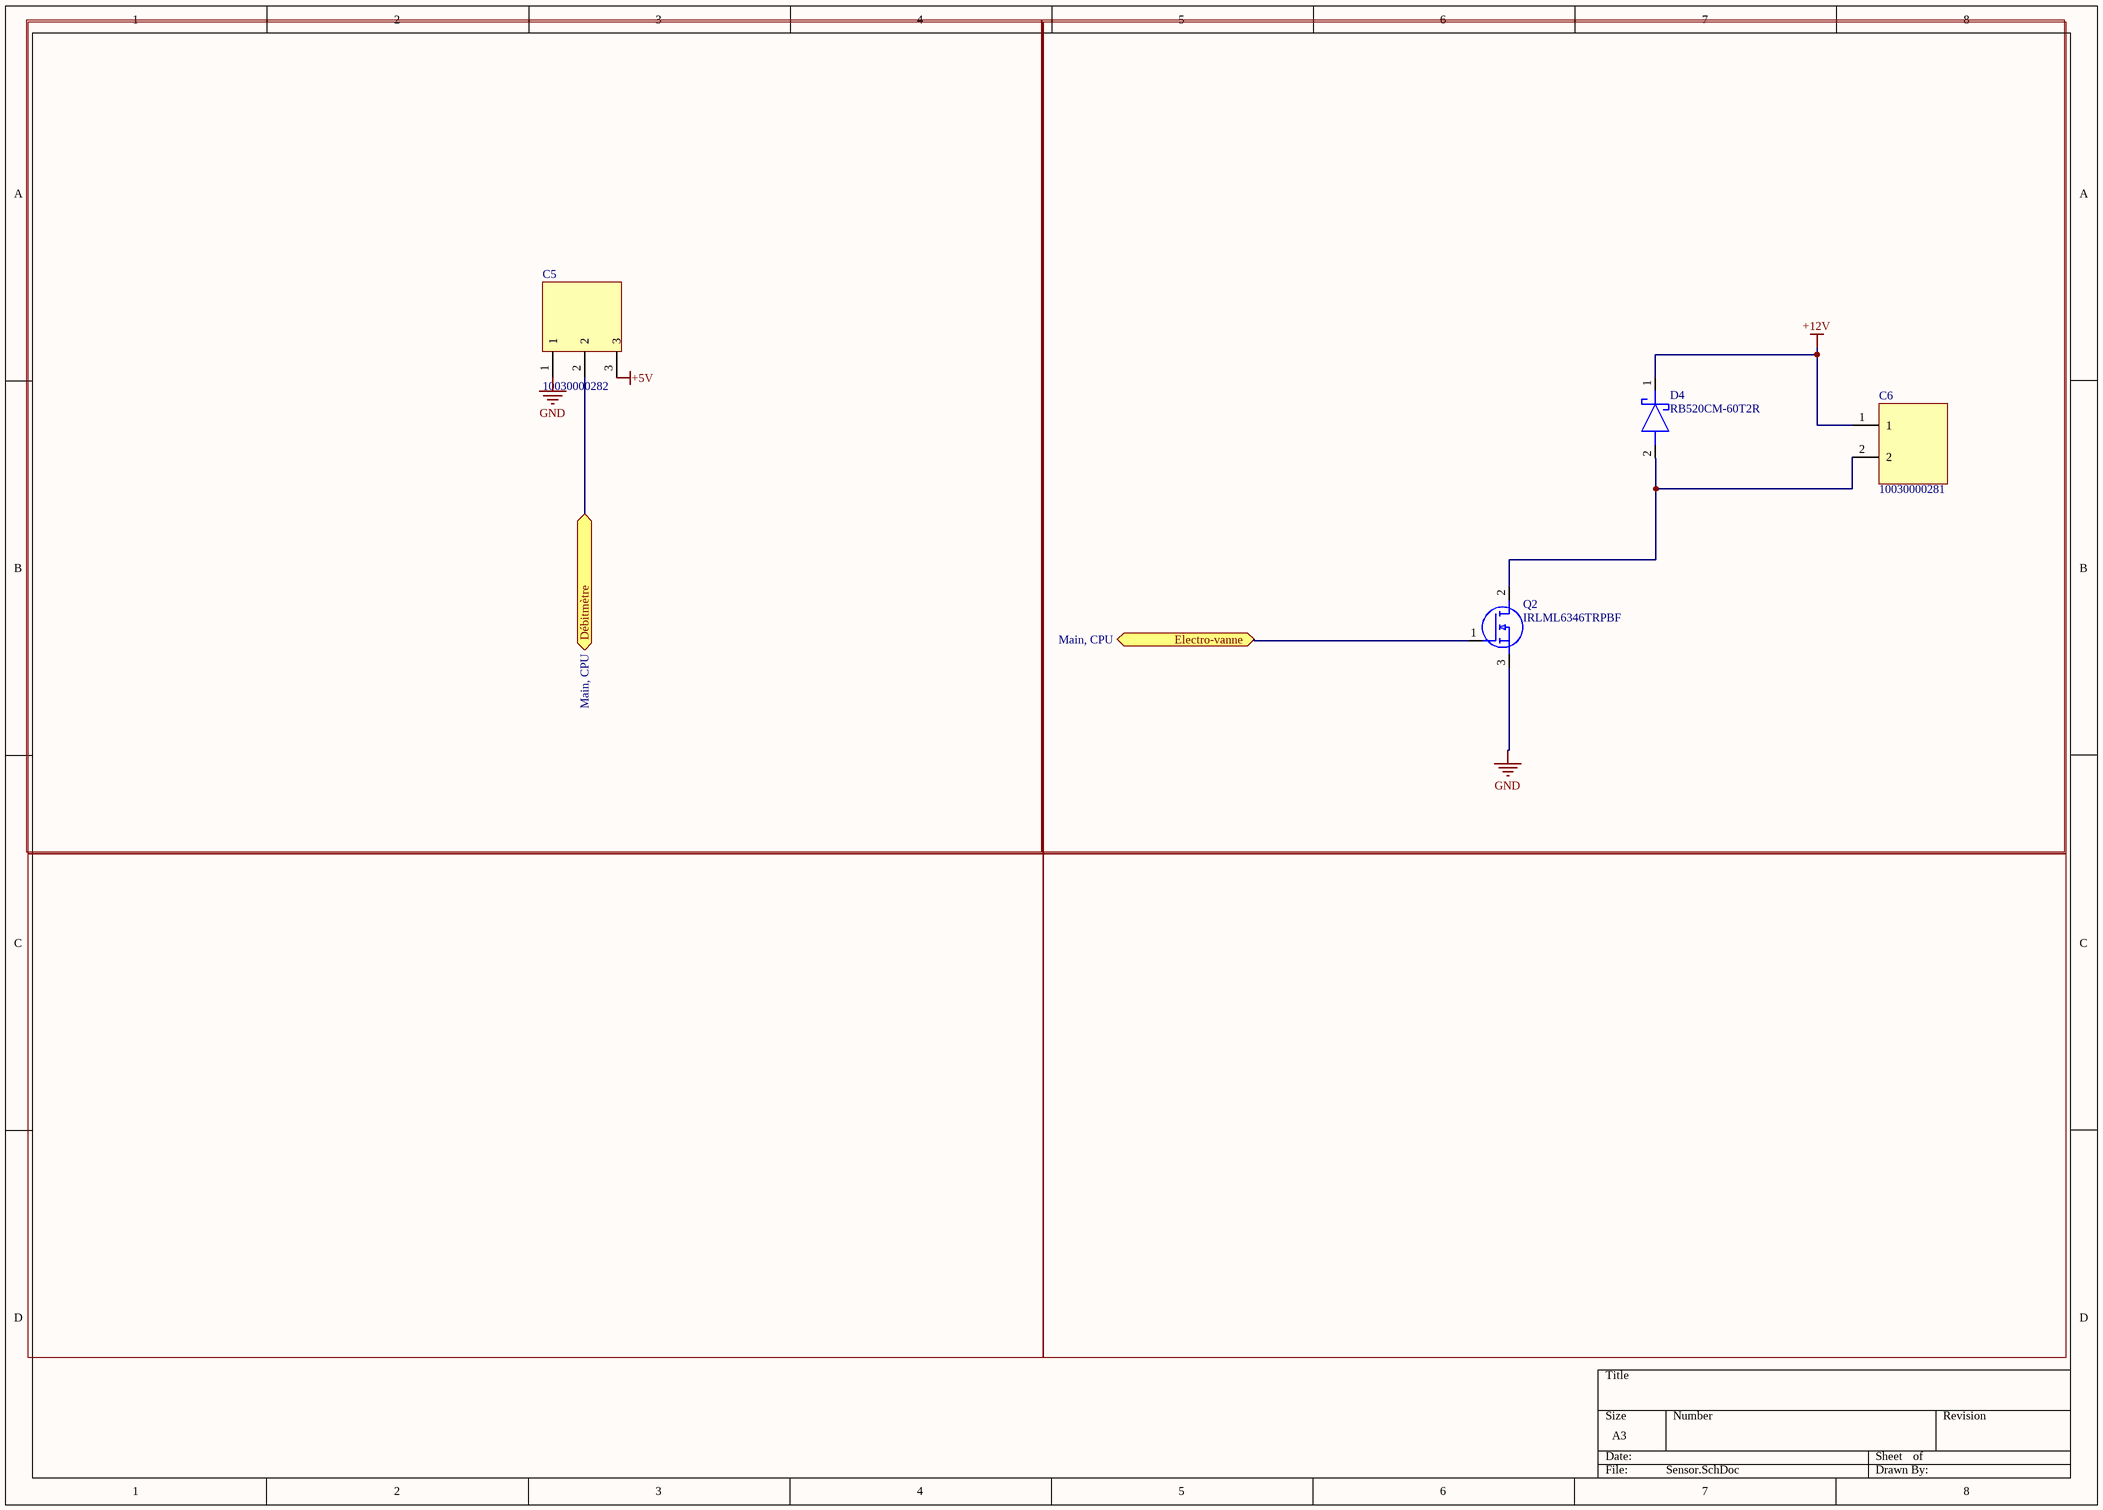
[diagram p4: Sensor.SchDoc]

### Parts
C5  10030000282  [15EDGRC-5.08-03P-10030000282]
C6  10030000281  [5EDGRHC-7.62-02P-10020000939]
D4  RB520CM-60T2R  [1SS400CSFHT2RA]
Q2  IRLML6346TRPBF  [SOT95P237X112-3N]

### Ports
Débitmètre (bidir, see Main, CPU), Electro-vanne (bidir, see Main, CPU)

### Nets
+5V: C5.3
+12V: C6.1 D4.1(K)
GND: C5.1 Q2.3(S)
NetC5_2: C5.2 ; port Débitmètre
NetC6_2: C6.2 D4.2(A) Q2.2(D)
NetQ2_1: Q2.1(G) ; port Electro-vanne

### Library data of the parts
C5 = 15EDGRC-5.08-03P: Pluggable Terminal Blocksnominal current7A.Rated voltage(Ⅱ/2)：450V,pitch:5.08mm,Color:green,Contact surface:Tin
C6 = 5EDGRHC-7.62-02P: Pluggable Terminal Blocksnominal current7A.Rated voltage(Ⅱ/2)：450V,pitch:5.08mm,Color:green,Contact surface:Tin
D4 = RB520CM-60T2R: Schottky Diode; Manufacturer_Name: ROHM Semiconductor; Datasheet Link: https://datasheet.datasheetarchive.com/originals/distributors/DKDS-18/356751.pdf; Height: 0.4mm; Manufacturer_Part_Number: RB520CM-60T2R; Mouser Part Number: 755-RB520CM-60T2R; Mouser Price/Stock: https://www.mouser.co.uk/ProductDetail/ROHM-Semiconductor/RB520CM-60T2R?qs=%2FKR40Cd6GUpWo9GUBmk4zQ%3D%3D
Q2 = IRLML6346TRPBF: MOSFET MOSFT 3.4A 63mOhm 30V 2.5V drv capable; Manufacturer_Name: Infineon; Manufacturer_Part_Number: IRFR2905ZTRPBF; Geometry.Height: 2.52mm; Mouser Part Number: 942-IRLML6346TRPBF; Mouser Price/Stock: https://www.mouser.co.uk/ProductDetail/Infineon-IR/IRFR2905ZTRPBF?qs=Z8%252BeY1k3TIIasKM0WUX9RA%3D%3D; Datasheet Link: https://www.infineon.com/dgdl/irfr2905zpbf.pdf?fileId=5546d462533600a401535630e7222088

## Sheet Connecteur SIM7000G devbord .SchDoc
size A4; SheetNumber: 7; SheetTotal: 7
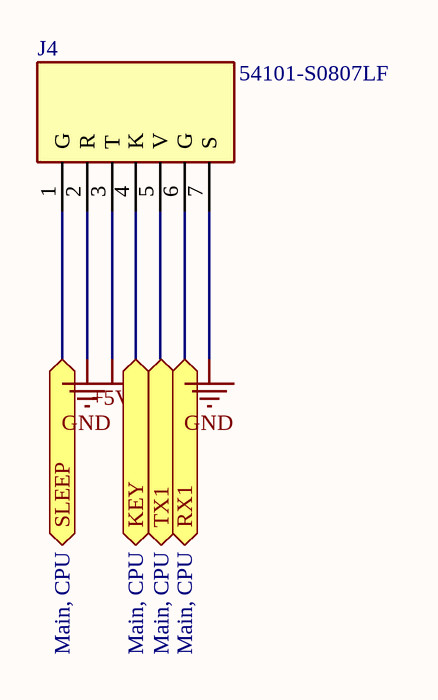
[diagram p5: Connecteur SIM7000G devbord .SchDoc]

### Parts
J4  54101-S0807LF  [54101S0807LF]

### Ports
KEY (bidir, see Main, CPU), RX1 (bidir, see Main, CPU), SLEEP (bidir, see Main, CPU), TX1 (bidir, see Main, CPU)

### Nets
+5V: J4.3(T)
GND: J4.2(R) J4.7(S)
NetJ4_1: J4.1(G) ; port SLEEP
NetJ4_4: J4.4(K) ; port KEY
NetJ4_5: J4.5(V) ; port TX1
NetJ4_6: J4.6(G) ; port RX1

### Library data of the parts
J4 = SIM7000G CONNETEUR: BergStik, Board to Board connector, Unshrouded vertical Header, Through Hole, Single Row, 6 Positions, 2.54 mm Pitch.; Manufacturer_Name: Amphenol Communication Solutions; Geometry.Height: 8.58mm; Mouser Part Number: 649-54101-S0807LF; Mouser Price/Stock: https://www.mouser.co.uk/ProductDetail/Amphenol-FCI/54101-S0803LF?qs=iiM6sTJtPEc921tw16XaKg%3D%3D; Manufacturer_Part_Number: 54101-S0807LF; Datasheet Link: https://cdn.amphenol-cs.com/media/wysiwyg/files/drawing/54101.pdf

## Sheet RS485.SchDoc
size A4; SheetNumber: 6; SheetTotal: 7
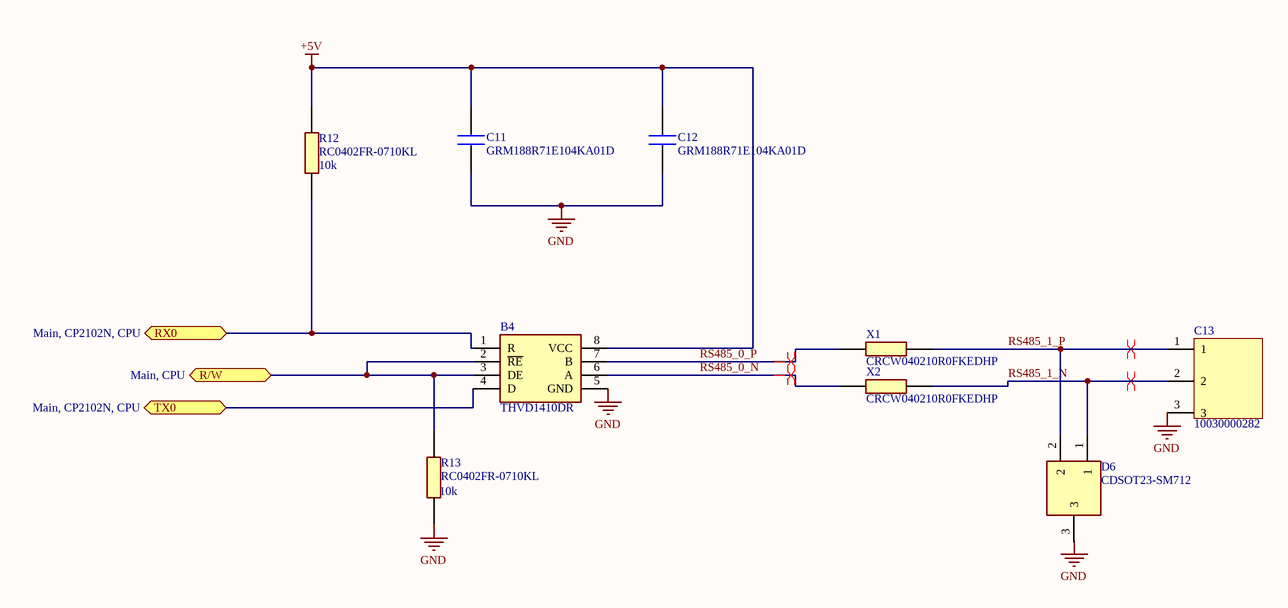
[diagram p6: RS485.SchDoc]

### Parts
B4  THVD1410DR  [SOIC127P600X175-8N]
C11  GRM188R71E104KA01D  [CAPC1608X90N]
C12  GRM188R71E104KA01D  [CAPC1608X90N]
C13  10030000282  [15EDGRC-5.08-03P-10030000282]
D6  CDSOT23-SM712  [SOT95P237X112-3N]
R12  RC0402FR-0710KL  value 10k  [RESC1005X40N]
R13  RC0402FR-0710KL  value 10k  [RESC1005X40N]
X1  CRCW040210R0FKEDHP  [RESC1005X40N]
X2  CRCW040210R0FKEDHP  [RESC1005X40N]

### Ports
R/W (bidir, see Main, CPU), RX0 (bidir, see Main, CP2102N, CPU), TX0 (bidir, see Main, CP2102N, CPU)

### Nets
+5V: B4.8(VCC) C11.2 C12.1 R12.2
GND: B4.5(GND) C11.1 C12.2 C13.3 R13.1
RS485_0_N: B4.6(A) X2.1
RS485_0_P: B4.7(B) X1.1
RS485_1_N: C13.2 D6.1 X2.2
RS485_1_P: C13.1 D6.2 X1.2
NetB1_25: B4.4(D) ; port TX0
NetB1_26: B4.1(R) R12.1 ; port RX0
NetB4_2: B4.2(~{RE}) B4.3(DE) R13.2 ; port R/W

Not connected (* = marked no-connect by the designer): D6 3

### Layout directives
differential pair: RS485_0_N, RS485_0_P, RS485_1_N, RS485_1_P

### Notes on the sheet
- Labels drawn without touching a wire or pin: GND

### Library data of the parts
B4 = THVD1410DR: 3.3-V to 5-V RS-485 transceiver with +/-18-kV IEC ESD protection; Manufacturer_Name: Texas Instruments; Geometry.Height: 1.75mm; Mouser Part Number: 595-THVD1410DR; Mouser Price/Stock: https://www.mouser.co.uk/ProductDetail/Texas-Instruments/THVD1410DR?qs=chTDxNqvsylen%252BY7bN3dRQ%3D%3D; Manufacturer_Part_Number: THVD1410DR; Datasheet Link: http://www.ti.com/lit/gpn/THVD1410
C11 C12 = GRM188R71E104KA01D: Ceramic  SMT capacitor 100nF 25Vdc Murata 0603 GRM 1uF Ceramic Multilayer Capacitor, 25 V dc, +125degC, X7R Dielectric,  /-10%; Manufacturer_Name: Murata Electronics; Manufacturer_Part_Number: GRM188R71E105KA12D; Geometry.Height: 0.9mm; Mouser Part Number: 81-GRM188R71E105KA2D; Mouser Price/Stock: https://www.mouser.co.uk/ProductDetail/Murata-Electronics/GRM188R71E105KA12D?qs=62qOe8%2Fl8sHaxJyNXtrK%2FQ%3D%3D; Datasheet Link: https://datasheet.datasheetarchive.com/originals/distributors/Datasheets_SAMA/ec4f1577dddcc7a13ddad897a28002d3.pdf
C13 = 15EDGRC-5.08-03P: as C5 on sheet Sensor
D6 = CDSOT23-SM712: Diode; Manufacturer_Name: Bourns; Datasheet Link: http://uk.rs-online.com/web/p/products/7673728; Height: 1.17mm; Manufacturer_Part_Number: CDSOT23-SM712; Mouser Part Number: 652-CDSOT23-SM712; Mouser Price/Stock: https://www.mouser.co.uk/ProductDetail/Bourns/CDSOT23-SM712?qs=FuI%252BOVLl4%2FLTY%2FGQ265RLA%3D%3D; Arrow Part Number: CDSOT23-SM712; Arrow Price/Stock: https://www.arrow.com/en/products/cdsot23-sm712/bourns?region=europe
R12 R13 = RC0402FR-0710KL: as R2 on sheet CPU; Mouser Part Number: 603-RC0402FR-0710KL; Mouser Price/Stock: https://www.mouser.co.uk/ProductDetail/YAGEO/RC0402FR-0710KL?qs=I1mnnYJTTsxUoNwrUsQExA%3D%3D; Manufacturer_Name: YAGEO; Manufacturer_Part_Number: RC0402FR-0710KL; Datasheet Link: https://componentsearchengine.com/Datasheets/2/RC0402FR-0710KL.pdf; Supplier Part Number 1: 7468275; Supplier 1: Future Electronics
X1 X2 = CRCW040210R0FKEDHP: Résistances à couches épaisses - CMS 0.2W 10ohms 1% High Power AEC-Q200; Manufacturer_Name: Vishay; Geometry.Height: 0.4mm; Mouser Part Number: 71-CRCW040210R0FKEDH; Mouser Price/Stock: https://www.mouser.co.uk/ProductDetail/Vishay-Dale/CRCW040227K4FKTD?qs=r5im4gEiTnFagxYI2ivMOg%3D%3D; Manufacturer_Part_Number: CRCW040210R0FKEDHP; Datasheet Link: http://www.vishay.com/docs/20035/dcrcwe3.pdf; Supplier 1: Mouser; Supplier Part Number 1: 71-CRCW040210R0FKEDH

## Nets that join several sheets
+3V3: CPU (7 pins), CP2102N (R9.1), Power 3v3 (C9.2 D5.5)
+5V: CP2102N (9 pins), Power 3v3 (5 pins), Sensor (C5.3), Connecteur SIM7000G devbord  (J4.3), RS485 (B4.8 C11.2 C12.1 R12.2)
+12V: Power 3v3 (B3.1 C7.2 J3.A1 J3.B1), Sensor (C6.1 D4.1)
GND: CPU (32 pins), CP2102N (12 pins), Power 3v3 (8 pins), Sensor (C5.1 Q2.3), Connecteur SIM7000G devbord  (J4.2 J4.7), RS485 (5 pins)
Boot: CPU (S3.2 U1.25), CP2102N (Q1.3)
NetB1_25: CPU (U1.35), CP2102N (B1.25), RS485 (B4.4)
NetB1_26: CPU (U1.34), CP2102N (B1.26), RS485 (B4.1 R12.1)
NetB4_2: CPU (U1.23), RS485 (B4.2 B4.3 R13.2)
NetC5_2: CPU (U1.16), Sensor (C5.2)
NetJ4_1: CPU (U1.13), Connecteur SIM7000G devbord  (J4.1)
NetJ4_4: CPU (U1.10), Connecteur SIM7000G devbord  (J4.4)
NetJ4_5: CPU (U1.11), Connecteur SIM7000G devbord  (J4.5)
NetJ4_6: CPU (U1.12), Connecteur SIM7000G devbord  (J4.6)
NetQ1_6: CPU (R2.1 S1.2 U1.3), CP2102N (Q1.6)
NetQ2_1: CPU (U1.26), Sensor (Q2.1)